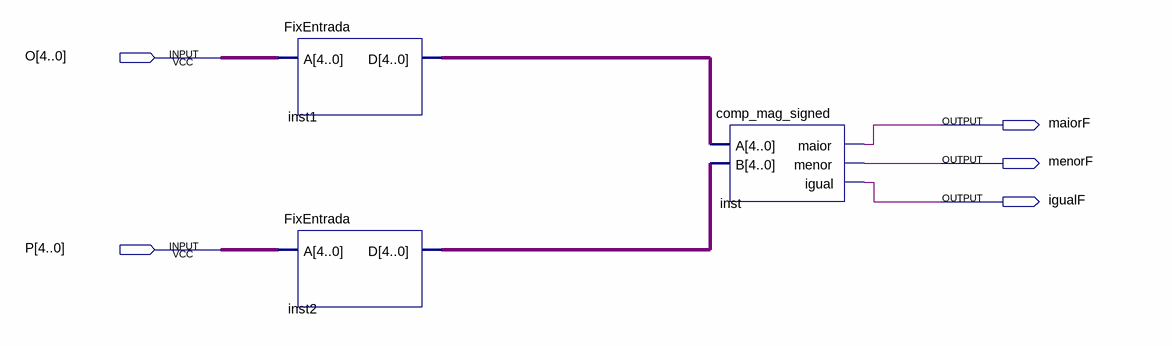
[diagram p0: schematic sheet]
// Quartus schematic ComparadorDefinitivo.bdf as structural Verilog: 3 symbols, 5 pins
module ComparadorDefinitivo (
  input  [4:0] O,
  input  [4:0] P,
  output maiorF,
  output menorF,
  output igualF
);

  wire [4:0] inst1_d, inst2_d;

  FixEntrada inst1 (.A(O), .D(inst1_d));
  FixEntrada inst2 (.A(P), .D(inst2_d));
  comp_mag_signed inst (.A(inst1_d), .B(inst2_d), .maior(maiorF), .menor(menorF), .igual(igualF));
endmodule
